# EAGLE schematic sim_adapter (EAGLE 6.5.0)
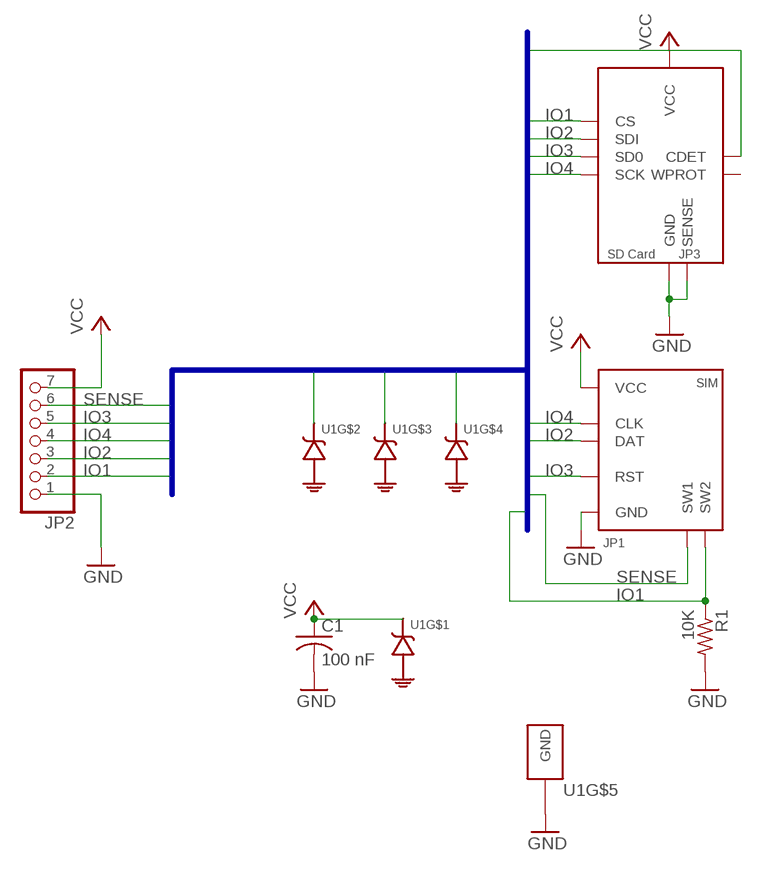
[diagram p0: schematic, sheet 1]

## Parts
C1  100 nF  C-USC0402  [C0402]
JP1  SIMHOLDER-8PINHING  [CCM03-SIMHOLDER]
JP2  PINHD-1X7  [1X07]
JP3  SDCARD-HOLDER  [SDHOLDER-9PIN]
R1  10K  R-US_R0603  [R0603]
U1  ESDA6V1SC6  [SOT23-6L]

## Nets
GND: C1.2 JP1.GND JP2.1 JP3.3(GND) JP3.6(GND) JP3.CDGND(SENSE) JP3.CDGND_BOT(SENSE) JP3.WPGND(SENSE) JP3.WPGND_BOT(SENSE) R1.2 U1.2 U1.5
IO1: JP1.SW2 JP2.2 JP3.1(CS) R1.1
IO2: JP1.IO(DAT) JP2.3 JP3.2(SDI) U1.3
IO3: JP1.RESET(RST) JP2.5 JP3.7(SD0) U1.4
IO4: JP1.CLOCK(CLK) JP2.4 JP3.5(SCK) U1.6
SENSE: JP1.SW1 JP2.6 JP3.CDETECT(CDET)
VCC: C1.1 JP1.VCC JP2.7 JP3.4(VCC) U1.1
Unconnected: JP3.WPROTECT(WPROT)

## Buses
SIMBUS:IO1,IO2,IO3,IO4,SENSE

## Library data of the parts
C1 = rcl:C-US: CAPACITOR, American symbol; DIGIKEY-PN: 445-1265-1-ND
JP1 = components:SIMHOLDER-8PIN; DESCRIPTION: Hinged SIM Card Holder; DIGIKEY-PN: 401-1722-1-ND
JP2 = pinhead:PINHD-1X7: PIN HEADER
JP3 = components:SDCARD-HOLDER; DIGIKEY-PN: 732-3817-1-ND; POPULATE-SIM: no
R1 = rcl:R-US_: RESISTOR, American symbol; DIGIKEY-PN: P10.0KHCT-ND
U1 = components:ESDA6V1SC6: ESD Diode Array (4-pack)